# Altium schematic sheet Sheet1.SchDoc
size B
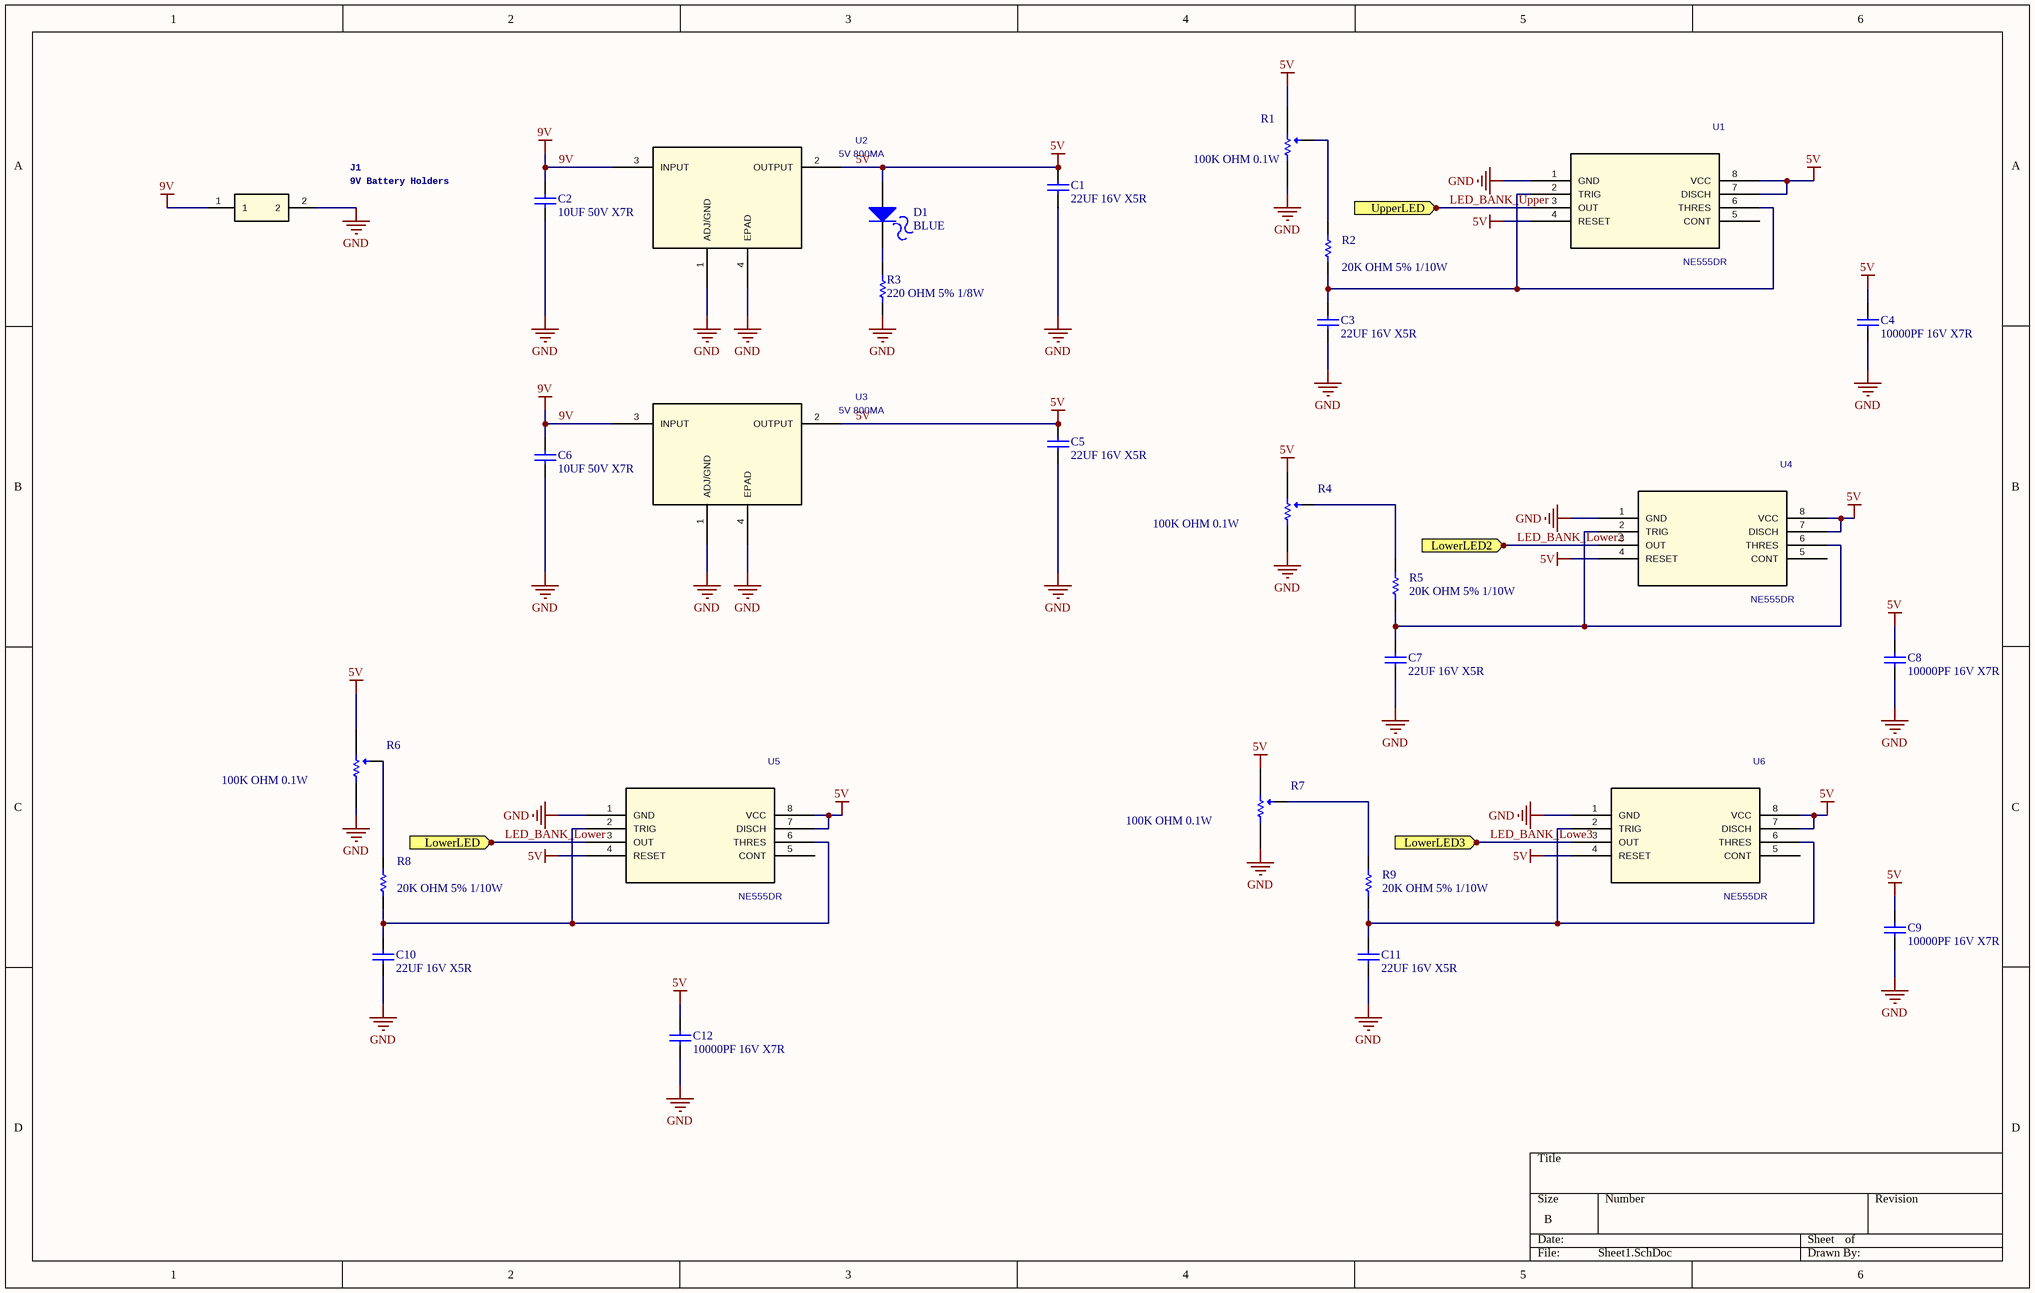
[diagram p0: Sheet1.SchDoc]

## Parts
C1  22UF 16V X5R  [SMD-0805C]
C2  10UF 50V X7R  [2220 cap]
C3  22UF 16V X5R  [SMD-0805C]
C4  10000PF 16V X7R  [SMD-0603C]
C5  22UF 16V X5R  [SMD-0805C]
C6  10UF 50V X7R  [2220 cap]
C7  22UF 16V X5R  [SMD-0805C]
C8  10000PF 16V X7R  [SMD-0603C]
C9  10000PF 16V X7R  [SMD-0603C]
C10  22UF 16V X5R  [SMD-0805C]
C11  22UF 16V X5R  [SMD-0805C]
C12  10000PF 16V X7R  [SMD-0603C]
D1  BLUE  [0603 LED BLUE]
J1  9V Battery Holders  [1294]
R1  100K OHM 0.1W  [3.80mm x 3.60mm x 1.20mm POT]
R2  20K OHM 5% 1/10W  [SMD-0603-RES]
R3  220 OHM 5% 1/8W  [SMD-0805-RES]
R4  100K OHM 0.1W  [3.80mm x 3.60mm x 1.20mm POT]
R5  20K OHM 5% 1/10W  [SMD-0603-RES]
R6  100K OHM 0.1W  [3.80mm x 3.60mm x 1.20mm POT]
R7  100K OHM 0.1W  [3.80mm x 3.60mm x 1.20mm POT]
R8  20K OHM 5% 1/10W  [SMD-0603-RES]
R9  20K OHM 5% 1/10W  [SMD-0603-RES]
U1  NE555DR  [SOIC 8 TI]
U2  5V 800MA  [SOT-223]
U3  5V 800MA  [SOT-223]
U4  NE555DR  [SOIC 8 TI]
U5  NE555DR  [SOIC 8 TI]
U6  NE555DR  [SOIC 8 TI]

## Ports
LowerLED, LowerLED2, LowerLED3, UpperLED

## Nets
5V: C1.2 C4.2 C5.2 C8.2 C9.2 C12.2 D1.1(Anode) R1.3 R4.3 R6.3 R7.3 U1.4(RESET) U1.7(DISCH) U1.8(VCC) U2.2(OUTPUT) U3.2(OUTPUT) U4.4(RESET) U4.7(DISCH) U4.8(VCC) U5.4(RESET) U5.7(DISCH) U5.8(VCC) U6.4(RESET) U6.7(DISCH) U6.8(VCC)
9V: C2.2 C6.2 J1.1 U2.3(INPUT) U3.3(INPUT)
GND: C1.1 C2.1 C3.1 C4.1 C5.1 C6.1 C7.1 C8.1 C9.1 C10.1 C11.1 C12.1 J1.2 R1.1 R3.1 R4.1 R6.1 R7.1 U1.1(GND) U2.1(ADJ/GND) U2.4(EPAD) U3.1(ADJ/GND) U3.4(EPAD) U4.1(GND) U5.1(GND) U6.1(GND)
LED_BANK_Lowe3: U6.3(OUT) ; port LowerLED3
LED_BANK_Lower: U5.3(OUT) ; port LowerLED
LED_BANK_Lower2: U4.3(OUT) ; port LowerLED2
LED_BANK_Upper: U1.3(OUT) ; port UpperLED
NetC3_2: C3.2 R2.1 U1.2(TRIG) U1.6(THRES)
NetC7_2: C7.2 R5.1 U4.2(TRIG) U4.6(THRES)
NetC10_2: C10.2 R8.1 U5.2(TRIG) U5.6(THRES)
NetC11_2: C11.2 R9.1 U6.2(TRIG) U6.6(THRES)
NetD1_2: D1.2(Cathode) R3.2
NetR1_2: R1.2 R2.2
NetR4_2: R4.2 R5.2
NetR6_2: R6.2 R8.2
NetR7_2: R7.2 R9.2

Not connected (* = marked no-connect by the designer): U1 5(CONT); U4 5(CONT); U5 5(CONT); U6 5(CONT)

## Library data of the parts
C1 C3 C5 C7 C10 C11 = CL21A226MOCLRNC: CAP CER 22UF 16V X5R 0805; Manufacturer: Samsung Electro-Mechanics; Number: CL21A226MOCLRNC
C2 C6 = CGA9N3X7R1H106K230KB: CAP CER 10UF 50V X7R 2220; Manufacturer: TDK Corporation; Number: CGA9N3X7R1H106K230KB
C4 C8 C9 C12 = C0603C103K4RACTU: CAP CER 10000PF 16V X7R 0603; Manufacturer: KEMET; Number: C0603C103K4RACTU
D1 = LTST-C190TBKT: LED BLUE CLEAR CHIP SMD; Manufacturer: Lite-On Inc.; Number: LTST-C190TBKT
J1 = 1294: BATTERY HOLDER 9V PC PIN; Manufacturer: Keystone Electronics; Number: 1294
R1 R4 R6 R7 = TC33X-2-104E: TRIMMER 100K OHM 0.1W J LEAD TOP; Manufacturer: TT Electronics/BI; Number: TC33X-2-104E
R2 R5 R8 R9 = RC0603JR-0720KL: RES SMD 20K OHM 5% 1/10W 0603; Manufacturer: Yageo; Number: RC0603JR-0720KL
R3 = RC0805JR-07220RL: RES SMD 220 OHM 5% 1/8W 0805; Manufacturer: Yageo; Number: RC0805JR-07220RL
U1 U4-U6 = NE555DR: IC OSC SGL TIMER 100KHZ 8-SOIC; Manufacturer: Texas Instruments; Number: NE555DR
U2 U3 = AZ1117CH-5.0TRG1: IC REG LINEAR 5V 800MA SOT223; Manufacturer: Diodes Incorporated; Number: AZ1117CH-3.3TRG1